# Altium schematic sheet tsop.SchDoc
size A4
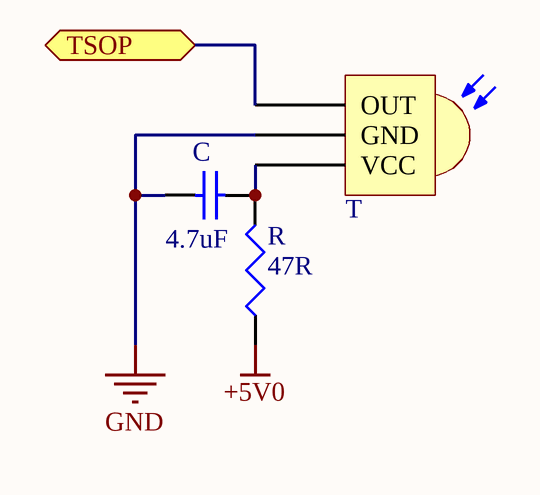
[diagram p0: tsop.SchDoc]

## Parts
C  value 4.7uF  [C0805C]  (hidden comment: CAP)
R  value 47R  [C0805R]  (hidden comment: RES)
T  TSOP7000  [TSOP IR]  (value not drawn)

## Ports
TSOP (bidir)

## Nets
+5V0: R.1
GND: C.2 T.2(GND)
TSOP: T.1(OUT) ; port TSOP
NetC_1: C.1 R.2 T.3(VCC)

## Library data of the parts
C = CAP: Capacitor; Published: 8-Jun-2000; LatestRevisionDate: 29-May-2009; LatestRevisionNote: IPC-7351 Footprint Added.; PackageReference: C1206; Publisher: Altium Limited; PackageDescription: Chip Capacitor
R = RES: Resistor; Published: 8-Jun-2000; LatestRevisionDate: 29-May-2009; LatestRevisionNote: IPC-7351 Footprint Added.; PackageReference: J1-0603; Publisher: Altium Limited; PackageDescription: Chip Resistor
T = TSOP7000: Vishay 455kHz IR Receiver